# Altium schematic sheet STLINKV2_V1.0.SchDoc
size A3
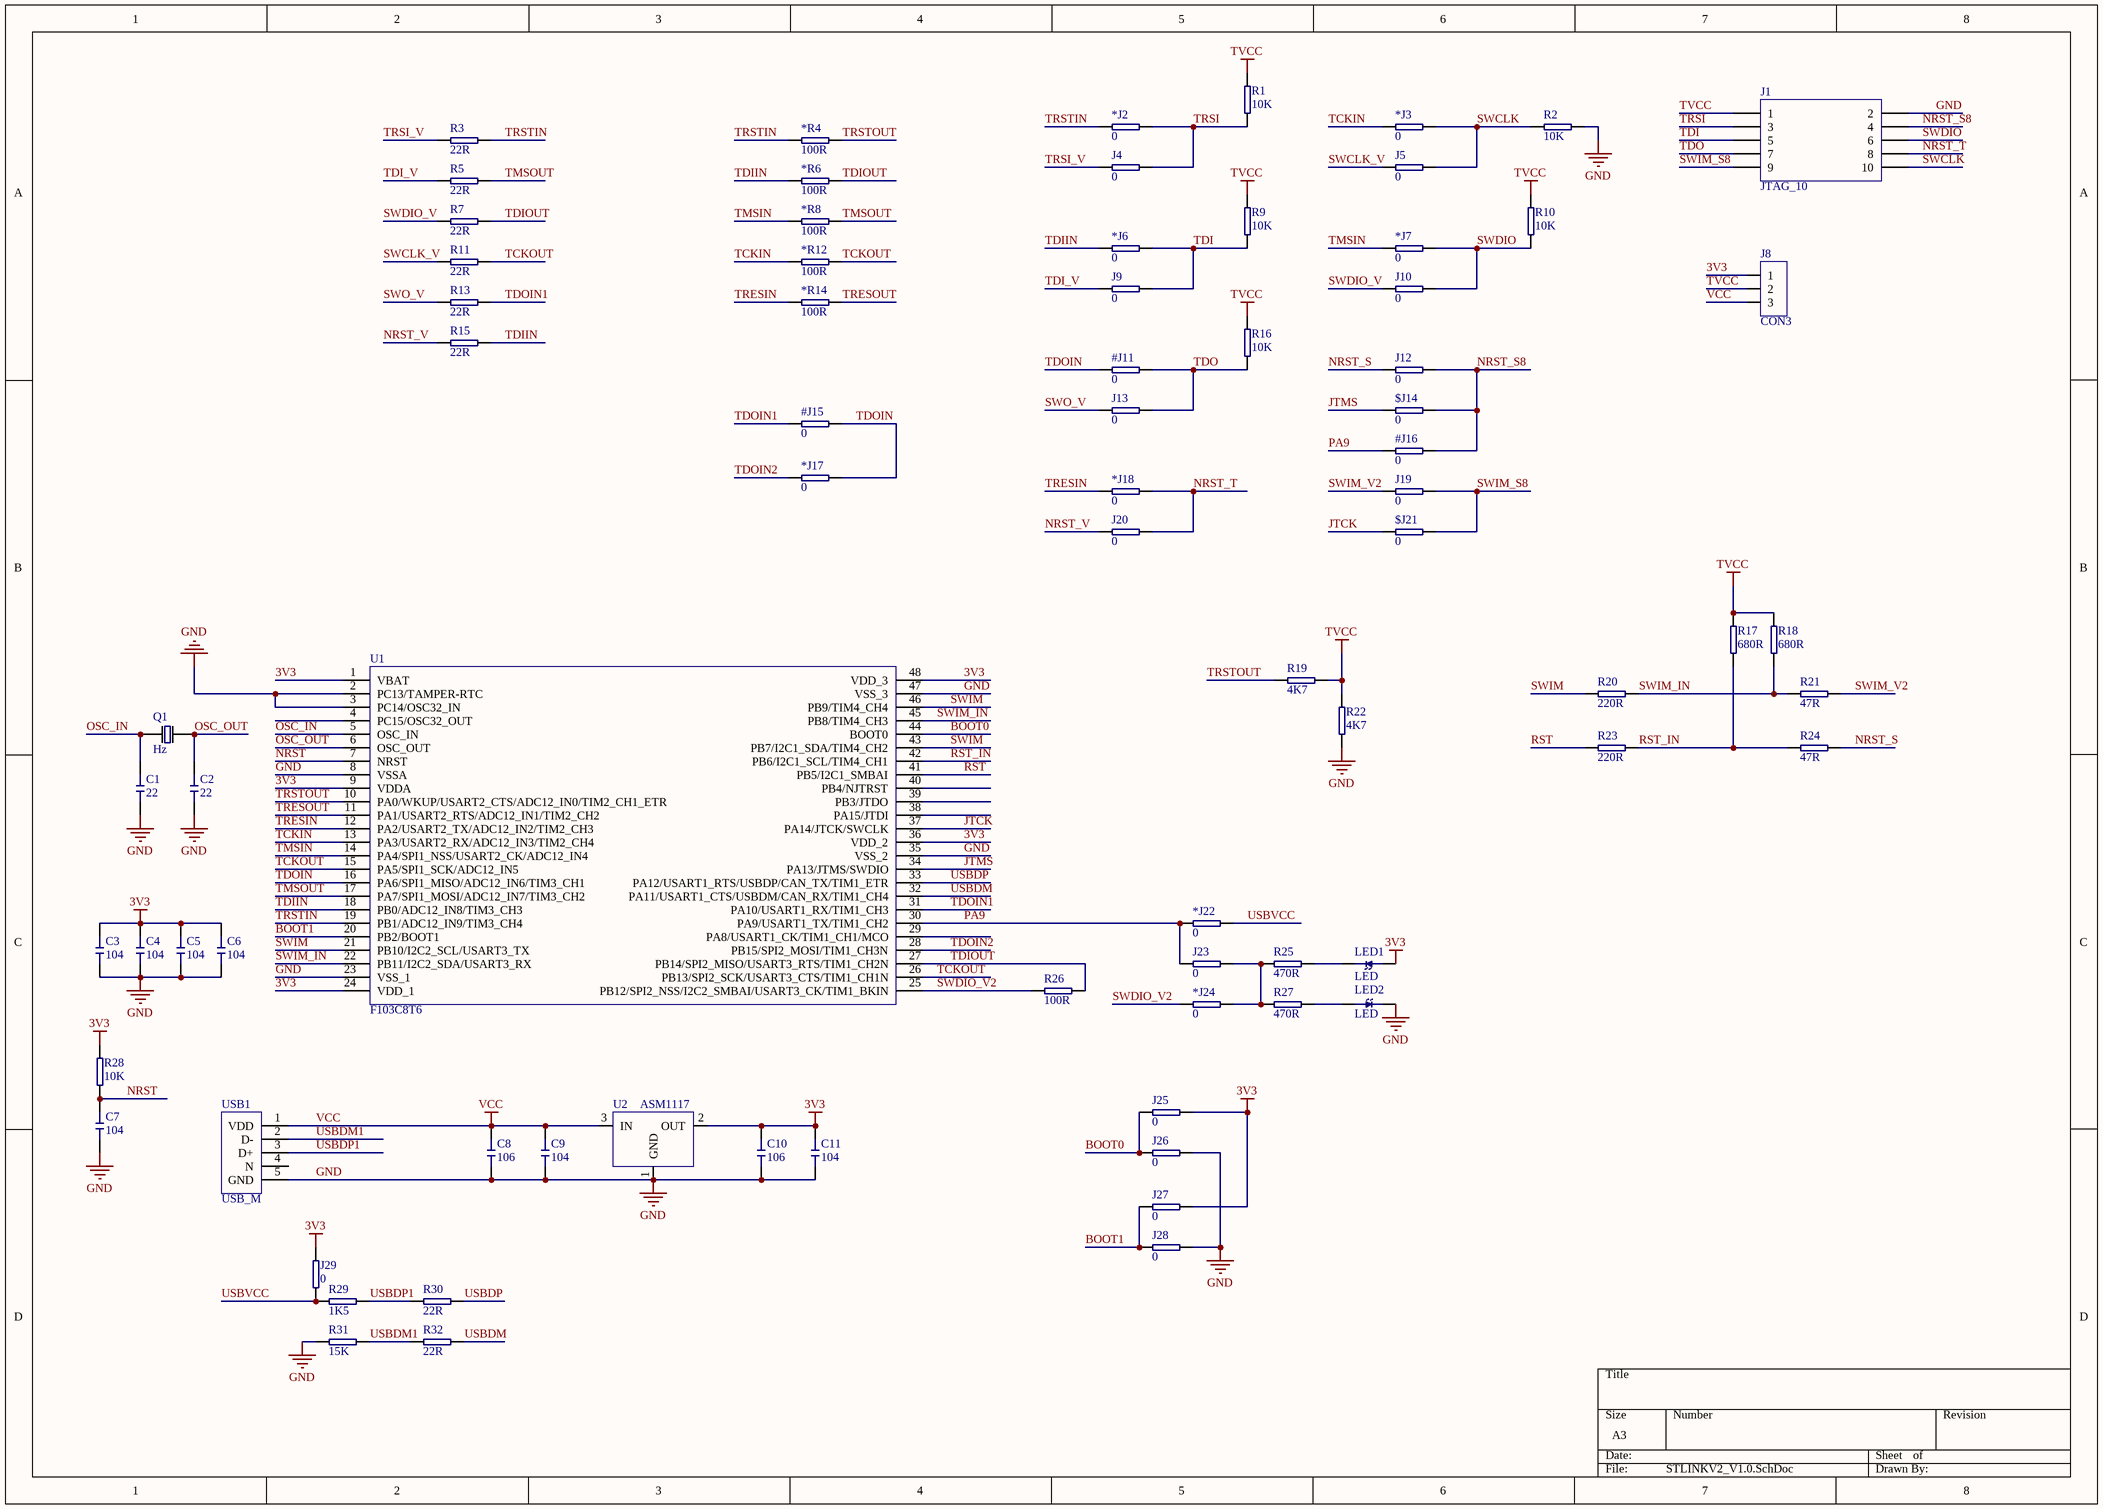
[diagram p0: STLINKV2_V1.0.SchDoc]

## Parts
#J11  0  [R0603]
#J15  0  [R0603]
#J16  0  [R0603]
$J14  0  [R0603]
$J21  0  [R0603]
*J2  0  [R0603]
*J3  0  [R0603]
*J6  0  [R0603]
*J7  0  [R0603]
*J17  0  [R0603]
*J18  0  [R0603]
*J22  0  [R0603]
*J24  0  [R0603]
*R4  100R  [R0603]
*R6  100R  [R0603]
*R8  100R  [R0603]
*R12  100R  [R0603]
*R14  100R  [R0603]
C1  22  [R0603]
C2  22  [R0603]
C3  104  [R0603]
C4  104  [R0603]
C5  104  [R0603]
C6  104  [R0603]
C7  104  [R0603]
C8  106  [R0805]
C9  104  [R0603]
C10  106  [R0805]
C11  104  [R0603]
J1  JTAG_10  [DC3-10_2.54_1]
J4  0  [R0603]
J5  0  [R0603]
J8  CON3  [CON3_1.0_2.54]
J9  0  [R0603]
J10  0  [R0603]
J12  0  [R0603]
J13  0  [R0603]
J19  0  [R0603]
J20  0  [R0603]
J23  0  [R0603]
J25  0  [R0603]
J26  0  [R0603]
J27  0  [R0603]
J28  0  [R0603]
J29  0  [R0603]
LED1  LED  [LED_3MM]
LED2  LED  [LED_3MM]
Q1  Hz  [JZ_1]
R1  10K  [R0603]
R2  10K  [R0603]
R3  22R  [R0603]
R5  22R  [R0603]
R7  22R  [R0603]
R9  10K  [R0603]
R10  10K  [R0603]
R11  22R  [R0603]
R13  22R  [R0603]
R15  22R  [R0603]
R16  10K  [R0603]
R17  680R  [R0603]
R18  680R  [R0603]
R19  4K7  [R0603]
R20  220R  [R0603]
R21  47R  [R0603]
R22  4K7  [R0603]
R23  220R  [R0603]
R24  47R  [R0603]
R25  470R  [R0603]
R26  100R  [R0603]
R27  470R  [R0603]
R28  10K  [R0603]
R29  1K5  [R0603]
R30  22R  [R0603]
R31  15K  [R0603]
R32  22R  [R0603]
U1  F103C8T6  [LQFP48]
U2  ASM1117  [SOT-223]
USB1  USB_M  [USB_MINI]

## Nets
3V3: C3.2 C4.2 C5.2 C6.2 C10.2 C11.2 J8.1 J25.2 J27.2 J29.2 LED1.1 R28.1 U1.1(VBAT) U1.9(VDDA) U1.24(VDD_1) U1.36(VDD_2) U1.48(VDD_3) U2.2(OUT)
GND: C1.1 C2.1 C3.1 C4.1 C5.1 C6.1 C7.1 C8.1 C9.1 C10.1 C11.1 J1.2 J26.2 J28.2 LED2.2 R2.1 R22.2 R31.2 U1.2(PC13/TAMPER-RTC) U1.3(PC14/OSC32_IN) U1.8(VSSA) U1.23(VSS_1) U1.35(VSS_2) U1.47(VSS_3) U2.1(GND) USB1.5(GND)
TVCC: J1.1 J8.2 R1.1 R9.1 R10.1 R16.1 R17.1 R18.1 R19.1 R22.1
VCC: C8.2 C9.2 J8.3 U2.3(IN) USB1.1(VDD)
BOOT0: J25.1 J26.1 U1.44(BOOT0)
BOOT1: J27.1 J28.1 U1.20(PB2/BOOT1)
JTCK: $J21.2 U1.37(PA14/JTCK/SWCLK)
JTMS: $J14.2 U1.34(PA13/JTMS/SWDIO)
NRST: C7.2 R28.2 U1.7(NRST)
NRST_S: J12.2 R24.1
NRST_S8: #J16.1 $J14.1 J1.4 J12.1
NRST_T: *J18.1 J1.8 J20.1
NRST_V: J20.2 R15.2
OSC_IN: C1.2 Q1.2 U1.5(OSC_IN)
OSC_OUT: C2.2 Q1.1 U1.6(OSC_OUT)
PA9: #J16.2 *J22.2 J23.2 U1.30(PA9/USART1_TX/TIM1_CH2)
RST: R23.2 U1.41(PB5/I2C1_SMBAI)
RST_IN: R17.2 R23.1 R24.2 U1.42(PB6/I2C1_SCL/TIM4_CH1)
SWCLK: *J3.1 J1.10 J5.1 R2.2
SWCLK_V: J5.2 R11.2
SWDIO: *J7.1 J1.6 J10.1 R10.2
SWDIO_V: J10.2 R7.2
SWDIO_V2: *J24.2 R26.2 U1.25(PB12/SPI2_NSS/I2C2_SMBAI/USART3_CK/TIM1_BKIN)
SWIM: R20.2 U1.21(PB10/I2C2_SCL/USART3_TX) U1.43(PB7/I2C1_SDA/TIM4_CH2) U1.46(PB9/TIM4_CH4)
SWIM_IN: R18.2 R20.1 R21.2 U1.22(PB11/I2C2_SDA/USART3_RX) U1.45(PB8/TIM4_CH3)
SWIM_S8: $J21.1 J1.9 J19.1
SWIM_V2: J19.2 R21.1
SWO_V: J13.2 R13.2
TCKIN: *J3.2 *R12.2 U1.13(PA3/USART2_RX/ADC12_IN3/TIM2_CH4)
TCKOUT: *R12.1 R11.1 U1.15(PA5/SPI1_SCK/ADC12_IN5) U1.26(PB13/SPI2_SCK/USART3_CTS/TIM1_CH1N)
TDI: *J6.1 J1.5 J9.1 R9.2
TDI_V: J9.2 R5.2
TDIIN: *J6.2 *R6.2 R15.1 U1.18(PB0/ADC12_IN8/TIM3_CH3)
TDIOUT: *R6.1 R7.1 R26.1 U1.27(PB14/SPI2_MISO/USART3_RTS/TIM1_CH2N)
TDO: #J11.1 J1.7 J13.1 R16.2
TDOIN: #J11.2 #J15.1 *J17.1 U1.16(PA6/SPI1_MISO/ADC12_IN6/TIM3_CH1)
TDOIN1: #J15.2 R13.1 U1.31(PA10/USART1_RX/TIM1_CH3)
TDOIN2: *J17.2 U1.28(PB15/SPI2_MOSI/TIM1_CH3N)
TMSIN: *J7.2 *R8.2 U1.14(PA4/SPI1_NSS/USART2_CK/ADC12_IN4)
TMSOUT: *R8.1 R5.1 U1.17(PA7/SPI1_MOSI/ADC12_IN7/TIM3_CH2)
TRESIN: *J18.2 *R14.2 U1.12(PA2/USART2_TX/ADC12_IN2/TIM2_CH3)
TRESOUT: *R14.1 U1.11(PA1/USART2_RTS/ADC12_IN1/TIM2_CH2)
TRSI: *J2.1 J1.3 J4.1 R1.2
TRSI_V: J4.2 R3.2
TRSTIN: *J2.2 *R4.2 R3.1 U1.19(PB1/ADC12_IN9/TIM3_CH4)
TRSTOUT: *R4.1 R19.2 U1.10(PA0/WKUP/USART2_CTS/ADC12_IN0/TIM2_CH1_ETR)
USBDM: R32.1 U1.32(PA11/USART1_CTS/USBDM/CAN_RX/TIM1_CH4)
USBDM1: R31.1 R32.2 USB1.2(D-)
USBDP: R30.1 U1.33(PA12/USART1_RTS/USBDP/CAN_TX/TIM1_ETR)
USBDP1: R29.1 R30.2 USB1.3(D+)
USBVCC: *J22.1 J29.1 R29.2
Net*J24_1: *J24.1 J23.1 R25.2 R27.2
NetLED1_2: LED1.2 R25.1
NetLED2_1: LED2.1 R27.1

Not connected (* = marked no-connect by the designer): U1 4(PC15/OSC32_OUT) 29(PA8/USART1_CK/TIM1_CH1/MCO) 38(PA15/JTDI) 39(PB3/JTDO) 40(PB4/NJTRST); USB1 4(N)

## Library data of the parts
#J11 #J15 #J16 $J14 $J21 *J2 *J3 *J6 *J7 *J17 *J18 *J22 *J24 *R4 *R6 *R8 *R12 *R14 J4 J5 J9 J10 J12 J13 J19 J20 J23 J25-J29 R1-R3 R5 R7 R9-R11 R13 R15-R32 = R
C1-C11 = C
Q1 = JZ
U1 = STM32F103C8T6